# EAGLE schematic stm32f103XX (EAGLE 7.2.0)
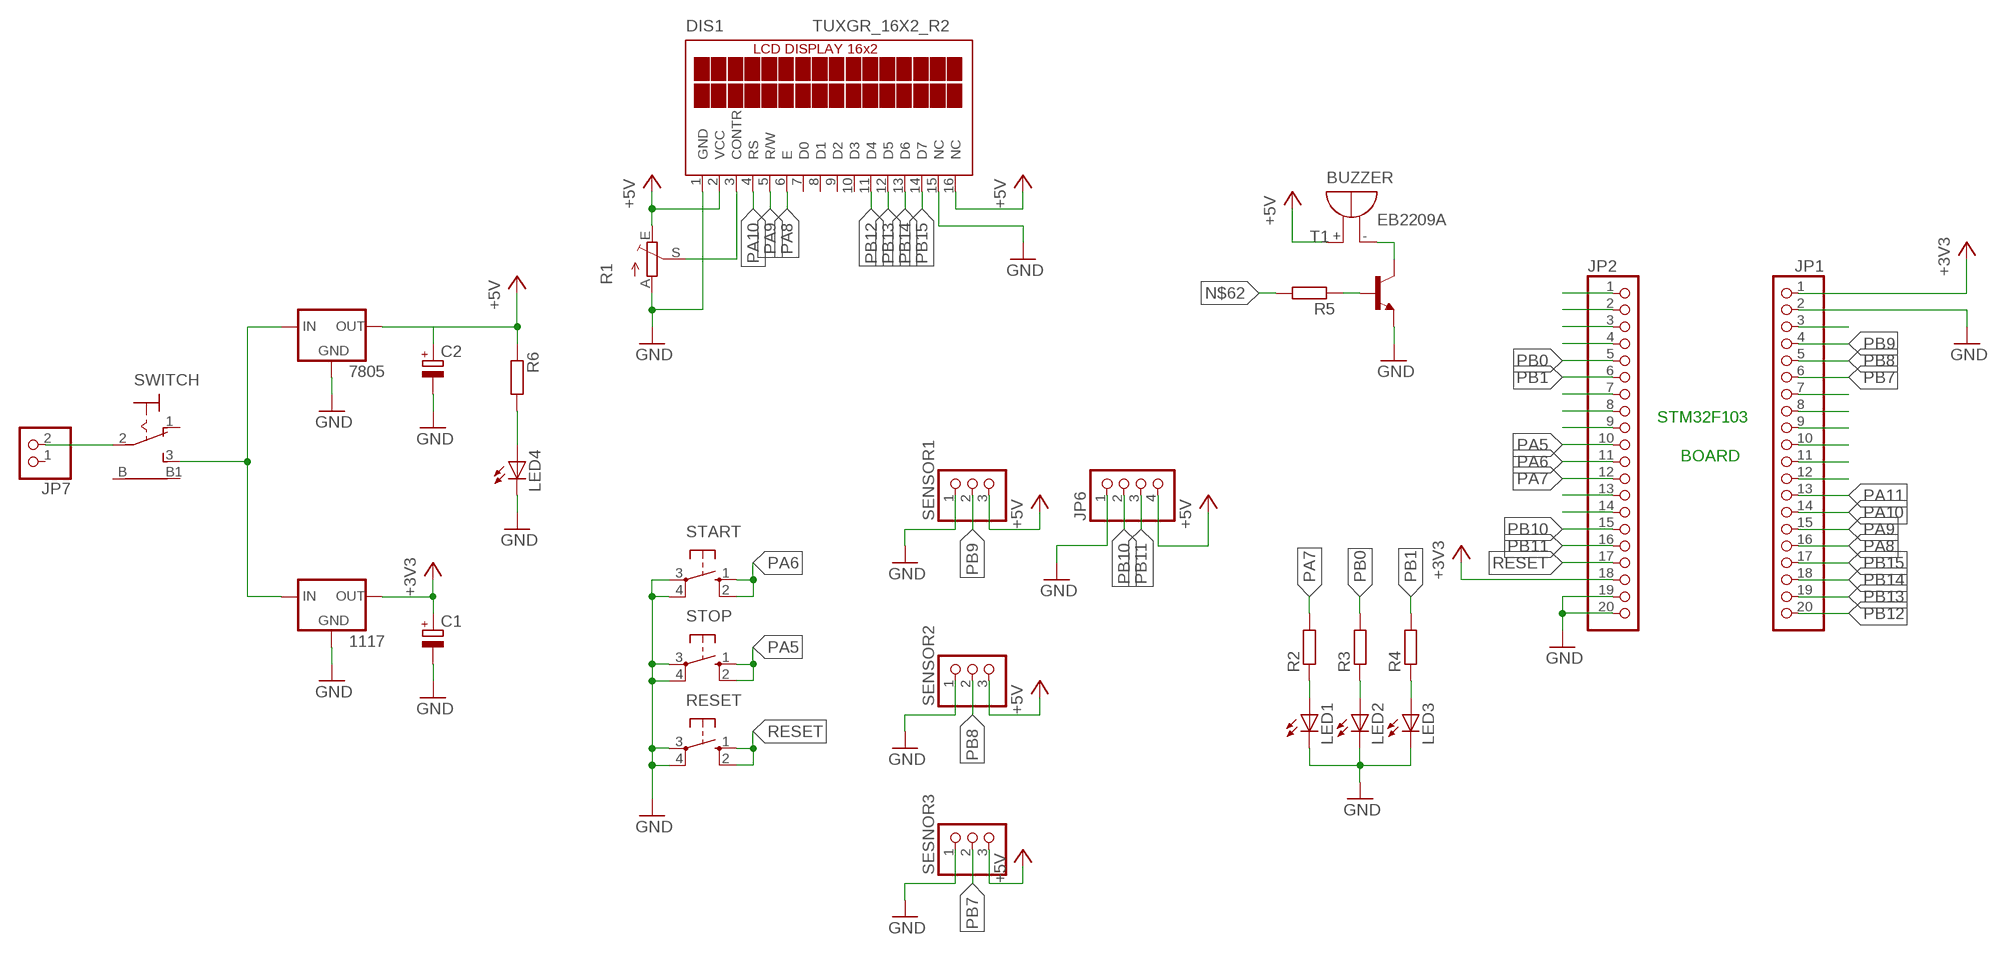
[diagram p0: schematic, sheet 1]

## Parts
1117  78XXL  [78XXL]
7805  78XXL  [78XXL]
BUZZER  EB2209A  [EB2209A]
C1  CPOL-EUE2.5-5  [E2,5-5]
C2  CPOL-EUE2.5-5  [E2,5-5]
DIS1  TUXGR_16X2_R2  [TUXGR_16X2_R2]
JP1  PINHD-1X20  [1X20]
JP2  PINHD-1X20  [1X20]
JP6  PINHD-1X4/90  [1X04/90]
JP7  PINHD-1X2  [1X02]
LED1  LED3MM  [LED3MM]
LED2  LED3MM  [LED3MM]
LED3  LED3MM  [LED3MM]
LED4  LED3MM  [LED3MM]
R1  TRIM_EU-CA6V  [CA6V]
R2  R-EU_M0805  [M0805]
R3  R-EU_M0805  [M0805]
R4  R-EU_M0805  [M0805]
R5  R-EU_M0805  [M0805]
R6  R-EU_M0805  [M0805]
RESET  40-XX  [B3F-40XX]
SENSOR1  PINHD-1X3/90  [1X03/90]
SENSOR2  PINHD-1X3/90  [1X03/90]
SESNOR3  PINHD-1X3/90  [1X03/90]
START  40-XX  [B3F-40XX]
STOP  40-XX  [B3F-40XX]
SWITCH  9070-1W  [9070-1W]
T1  -NPN-SOT23-EBC  [SOT23-EBC]

## Nets
+3V3: 1117.OUT C1.+ JP1.1 JP2.18
+5V: 7805.OUT BUZZER.+ C2.+ DIS1.2(VCC) DIS1.16(NC) JP6.4 R1.E R6.1 SENSOR1.3 SENSOR2.3 SESNOR3.3
GND: 1117.GND 7805.GND C1.- C2.- DIS1.1(GND) DIS1.15(NC) JP1.2 JP2.19 JP2.20 JP6.1 LED1.K(C) LED2.K(C) LED3.K(C) LED4.K(C) R1.A RESET.3(P) RESET.4(P1) SENSOR1.1 SENSOR2.1 SESNOR3.1 START.3(P) START.4(P1) STOP.3(P) STOP.4(P1) T1.E
N$3: JP1.3
N$7: JP1.7
N$8: JP1.8
N$9: JP1.9
N$10: JP1.10
N$11: JP1.11
N$12: JP1.12
N$21: JP2.1
N$22: JP2.2
N$23: JP2.3
N$24: JP2.4
N$27: JP2.7
N$28: JP2.8
N$29: JP2.9
N$33: JP2.13
N$34: JP2.14
N$41: DIS1.3(CONTR) R1.S
N$42: BUZZER.- T1.C
N$43: R5.1 T1.B
N$53: LED1.A R2.1
N$55: LED2.A R3.1
N$57: LED3.A R4.1
N$62: R5.2
N$64: 1117.IN 7805.IN SWITCH.3(S)
N$65: JP7.2 SWITCH.2(P)
N$66: LED4.A R6.2
PA5: JP2.10 STOP.1(S) STOP.2(S1)
PA6: JP2.11 START.1(S) START.2(S1)
PA7: JP2.12 R2.2
PA8: DIS1.6(E) JP1.16
PA9: DIS1.5(R/W) JP1.15
PA10: DIS1.4(RS) JP1.14
PA11: JP1.13
PB0: JP2.5 R3.2
PB1: JP2.6 R4.2
PB7: JP1.6 SESNOR3.2
PB8: JP1.5 SENSOR2.2
PB9: JP1.4 SENSOR1.2
PB10: JP2.15 JP6.2
PB11: JP2.16 JP6.3
PB12: DIS1.11(D4) JP1.20
PB13: DIS1.12(D5) JP1.19
PB14: DIS1.13(D6) JP1.18
PB15: DIS1.14(D7) JP1.17
RESET: JP2.17 RESET.1(S) RESET.2(S1)
Unconnected: DIS1.7(D0) DIS1.8(D1) DIS1.9(D2) DIS1.10(D3) JP7.1 SWITCH.1(O) SWITCH.B SWITCH.B1

## Notes on the sheet
- STM32F103
- BOARD

## Library data of the parts
1117 7805 = v-reg:78XXL: VOLTAGE REGULATOR
BUZZER = buzzer:EB2209A: BUZZER Source: Buerklin; OC_FARNELL: unknown; OC_NEWARK: unknown
C1 C2 = rcl:CPOL-EU: POLARIZED CAPACITOR, European symbol
DIS1 = display-lcd:TUXGR_16X2_R2: Tuxgraphics LCD display 16x2 characters reflective, without background light Source: tuxgr_12x2_r2.pdf; OC_FARNELL: unknown; OC_NEWARK: unknown
JP1 JP2 = pinhead:PINHD-1X20: PIN HEADER
JP6 = pinhead:PINHD-1X4: PIN HEADER
JP7 = pinhead:PINHD-1X2: PIN HEADER
LED1-LED4 = led:LED: LED OSRAM: - CHIPLED LG R971, LG N971, LY N971, LG Q971, LY Q971, LO R971, LY R971 LH N974, LH R974 LS Q976, LO Q976, LY Q976 LO Q996 - Hyper CHIPLED LW Q18S LB Q993, LB Q99A, LB R99A - SideLED LS A670, LO A670, LY A670, LG A670, LP A670 LB A673, LV A673, LT A673, LW A673 LH A674 LY A675 LS A676, LA A676, LO A676, LY A676, LW A676 LS A679, LY A679, LG A679 - Hyper Micro SIDELED® LS Y876, LA Y876, LO Y876, LY Y876 LT Y87S - SmartLED LW L88C, LW L88S LB L89C, LB L89S, LG L890 LS L89K, LO L89K, LY L89K LS L896, LA L896, LO L896, LY L896 - TOPLED LS T670, LO T670, LY T670, LG T670, LP T670 LSG T670, LSP T670, LSY T670, LOP T670, LYG T670 LG T671, LOG T671, LSG T671 LB T673, LV T673, LT T673, LW T673 LH T674 LS T676, LA T676, LO T676, LY T676, LB T676, LH T676, LSB T676, LW T676 LB T67C, LV T67C, LT T67C, LS T67K, LO T67K, LY T67K, LW E67C LS E67B, LA E67B, LO E67B, LY E67B, LB E67C, LV E67C, LT E67C LW T67C LS T679, LY T679, LG T679 LS T770, LO T770, LY T770, LG T770, LP T770 LB T773, LV T773, LT T773, LW T773 LH T774 LS E675, LA E675, LY E675, LS T675 LS T776, LA T776, LO T776, LY T776, LB T776 LHGB T686 LT T68C, LB T68C - Hyper Mini TOPLED® LB M676 - Mini TOPLED Santana® LG M470 LS M47K, LO M47K, LY M47K Source: http://www.osram.convergy.de LUXEON: - LUMILED® LXK2-PW12-R00, LXK2-PW12-S00, LXK2-PW14-U00, LXK2-PW14-V00 LXK2-PM12-R00, LXK2-PM12-S00, LXK2-PM14-U00 LXK2-PE12-Q00, LXK2-PE12-R00, LXK2-PE12-S00, LXK2-PE14-T00, LXK2-PE14-U00 LXK2-PB12-K00, LXK2-PB12-L00, LXK2-PB12-M00, LXK2-PB14-N00, LXK2-PB14-P00, LXK2-PB14-Q00 LXK2-PR12-L00, LXK2-PR12-M00, LXK2-PR14-Q00, LXK2-PR14-R00 LXK2-PD12-Q00, LXK2-PD12-R00, LXK2-PD12-S00 LXK2-PH12-R00, LXK2-PH12-S00 LXK2-PL12-P00, LXK2-PL12-Q00, LXK2-PL12-R00 Source: www.luxeon.com KINGBRIGHT: KA-3528ASYC Source: www.kingbright.com
R1 = pot:TRIM_EU-: POTENTIOMETER
R2-R6 = resistor:R-EU_: RESISTOR, European symbol
RESET START STOP = switch-omron:40-XX: OMRON SWITCH; MF: OMRON COMPONENTS USA; MPN: B3F-4000; OC_FARNELL: 176434; OC_NEWARK: 36K3105
SENSOR1 SENSOR2 SESNOR3 = pinhead:PINHD-1X3: PIN HEADER
SWITCH = switch:9070-1W: TOGGLE SWITCH Marquardt
T1 = transistor:*-NPN-: NPN Transistror BF959 corrected 2008.03.06